# EAGLE schematic TestFetTurnOffBattery (EAGLE 8.2.0)
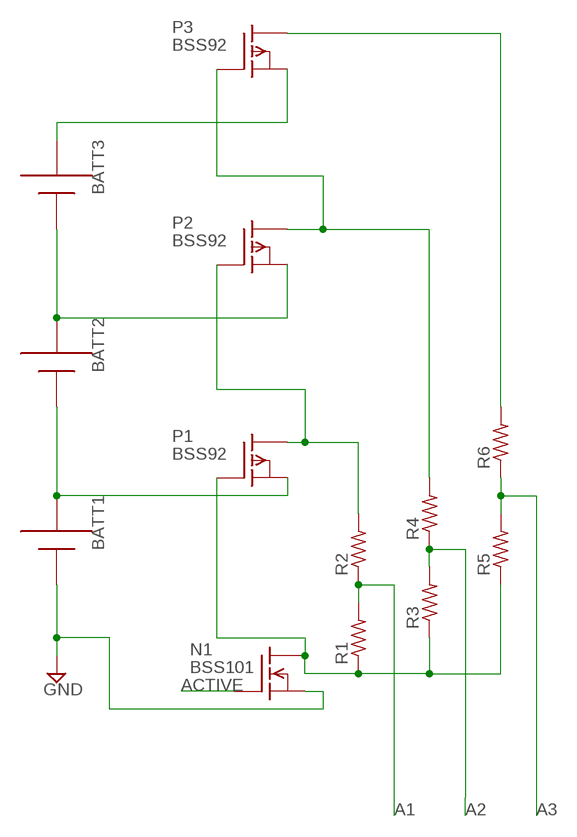
[diagram p0: schematic, sheet 1]

## Parts
BATT1  AAA  [12BH412]
BATT2  AAA  [12BH412]
BATT3  AAA  [12BH412]
N1  BSS101  [TO92]
P1  BSS92  [TO92]
P2  BSS92  [TO92]
P3  BSS92  [TO92]
R1  R-US_R0603  [R0603]
R2  R-US_R0603  [R0603]
R3  R-US_R0603  [R0603]
R4  R-US_R0603  [R0603]
R5  R-US_R0603  [R0603]
R6  R-US_R0603  [R0603]

## Nets
A1: R1.2 R2.1
A2: R3.2 R4.1
A3: R5.2 R6.1
ACTIVE: N1.2(G)
GND: BATT1.+ N1.1(S)
N$1: P1.2(D) P2.1(G) R2.2
N$2: BATT2.- BATT3.+ P2.3(S)
N$4: N1.3(D) P1.1(G) R1.1 R3.1 R5.1
N$5: BATT1.- BATT2.+ P1.3(S)
N$6: P2.2(D) P3.1(G) R4.2
N$7: BATT3.- P3.3(S)
N$9: P3.2(D) R6.2

## Library data of the parts
BATT1-BATT3 = adafruit:AAA: AAA PC pin holder Mouser part #12BH412 - but pretty much any 1x AAA battery holder should be the same http://www.ladyada.net/library/pcb/eaglelibrary.html
N1 = transistor-fet:BSS101: N-Channel Enhancement MOSFET 200V; 0,16A; 11Ohm
P1-P3 = transistor-fet:BSS92: P-Channel Enhancement MOSFET -200V; -0,15A; 11Ohm
R1-R6 = adafruit:R-US_: RESISTOR, American symbol